# Altium schematic sheet Sheet1.SchDoc
size A
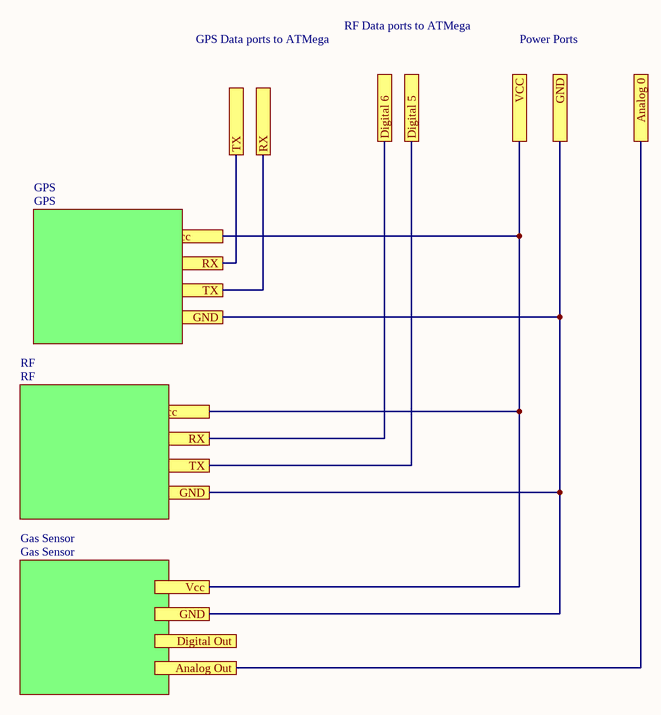
[diagram p0: Sheet1.SchDoc]

## Sub-sheets
Gas Sensor = Gas Sensor: no entries
GPS = GPS: no entries
RF = RF: no entries

## Ports
Analog 0, Analog Out, Digital 5, Digital 6, Digital Out, GND, RX, TX, Vcc, VCC

## Nets
Analog 0: port Analog Out, port Analog 0
Digital 5: port RX, port TX, port Digital 5, port Digital 6
Vcc: port Vcc, port VCC

## Notes on the sheet
- RF Data ports to ATMega
- GPS Data ports to ATMega
- Power Ports